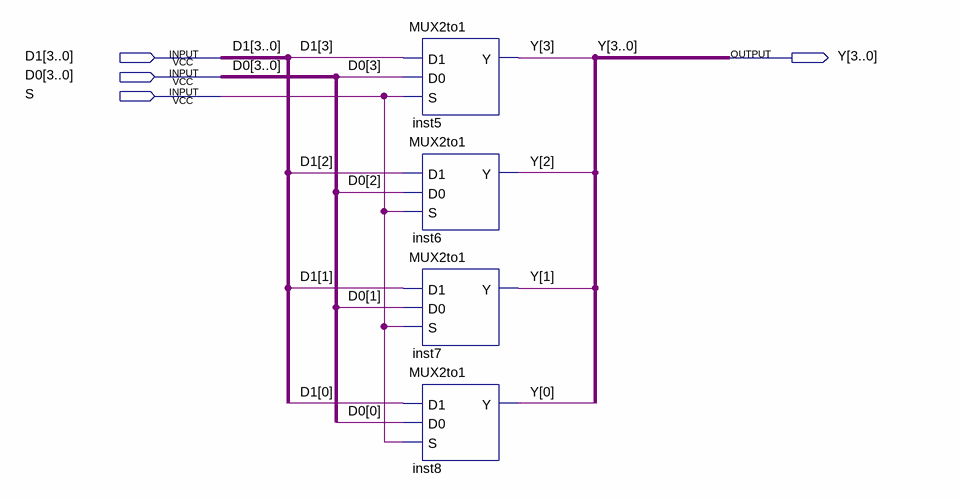
[diagram p0: schematic sheet]
// Quartus schematic MUX4.bdf as structural Verilog: 4 symbols, 4 pins
module MUX4 (
  input  [3:0] D1,
  input  [3:0] D0,
  input  S,
  output [3:0] Y
);

  MUX2to1 inst5 (.D1(D1[3]), .D0(D0[3]), .S(S), .Y(Y[3]));
  MUX2to1 inst6 (.D1(D1[2]), .D0(D0[2]), .S(S), .Y(Y[2]));
  MUX2to1 inst7 (.D1(D1[1]), .D0(D0[1]), .S(S), .Y(Y[1]));
  MUX2to1 inst8 (.D1(D1[0]), .D0(D0[0]), .S(S), .Y(Y[0]));
endmodule
